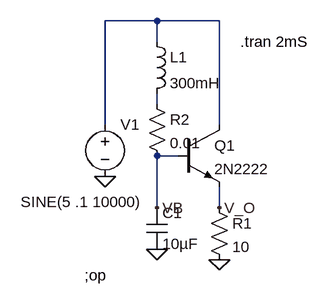
[diagram p0: schematic Smoother Circuitasc.asc]
Smoother Circuitasc.asc, the LTspice schematic file:
Version 4
SHEET 1 880 680
WIRE 128 -32 48 -32
WIRE 224 -32 128 -32
WIRE 128 0 128 -32
WIRE 128 96 128 80
WIRE 48 128 48 -32
WIRE 224 128 224 -32
WIRE 160 176 128 176
WIRE 128 256 128 176
WIRE 224 256 224 224
FLAG 224 336 0
FLAG 48 208 0
FLAG 224 256 V_O
FLAG 128 256 VB
FLAG 128 320 0
SYMBOL npn 160 128 R0
SYMATTR InstName Q1
SYMATTR Value 2N2222
SYMBOL voltage 48 112 R0
WINDOW 3 -130 135 Left 2
WINDOW 123 0 0 Left 0
WINDOW 39 0 0 Left 0
SYMATTR Value SINE(5 .1 10000)
SYMATTR InstName V1
SYMBOL res 208 240 R0
SYMATTR InstName R1
SYMATTR Value 10
SYMBOL res 112 80 R0
SYMATTR InstName R2
SYMATTR Value 0.01
SYMBOL cap 112 256 R0
SYMATTR InstName C1
SYMATTR Value 10µF
SYMBOL ind 112 -16 R0
SYMATTR InstName L1
SYMATTR Value 300mH
TEXT 16 360 Left 2 !;op
TEXT 256 0 Left 2 !.tran 2mS

The netlist it stands for:
* Smoother Circuitasc.asc
Q1 N001 VB V_O 0 2N2222
V1 N001 0 SINE(5 .1 10000)
R1 V_O 0 10
R2 N002 VB 0.01
C1 VB 0 10µF
L1 N001 N002 300mH
.model NPN NPN
.model PNP PNP
.lib standard.bjt
;op
.tran 2mS
.backanno
.end